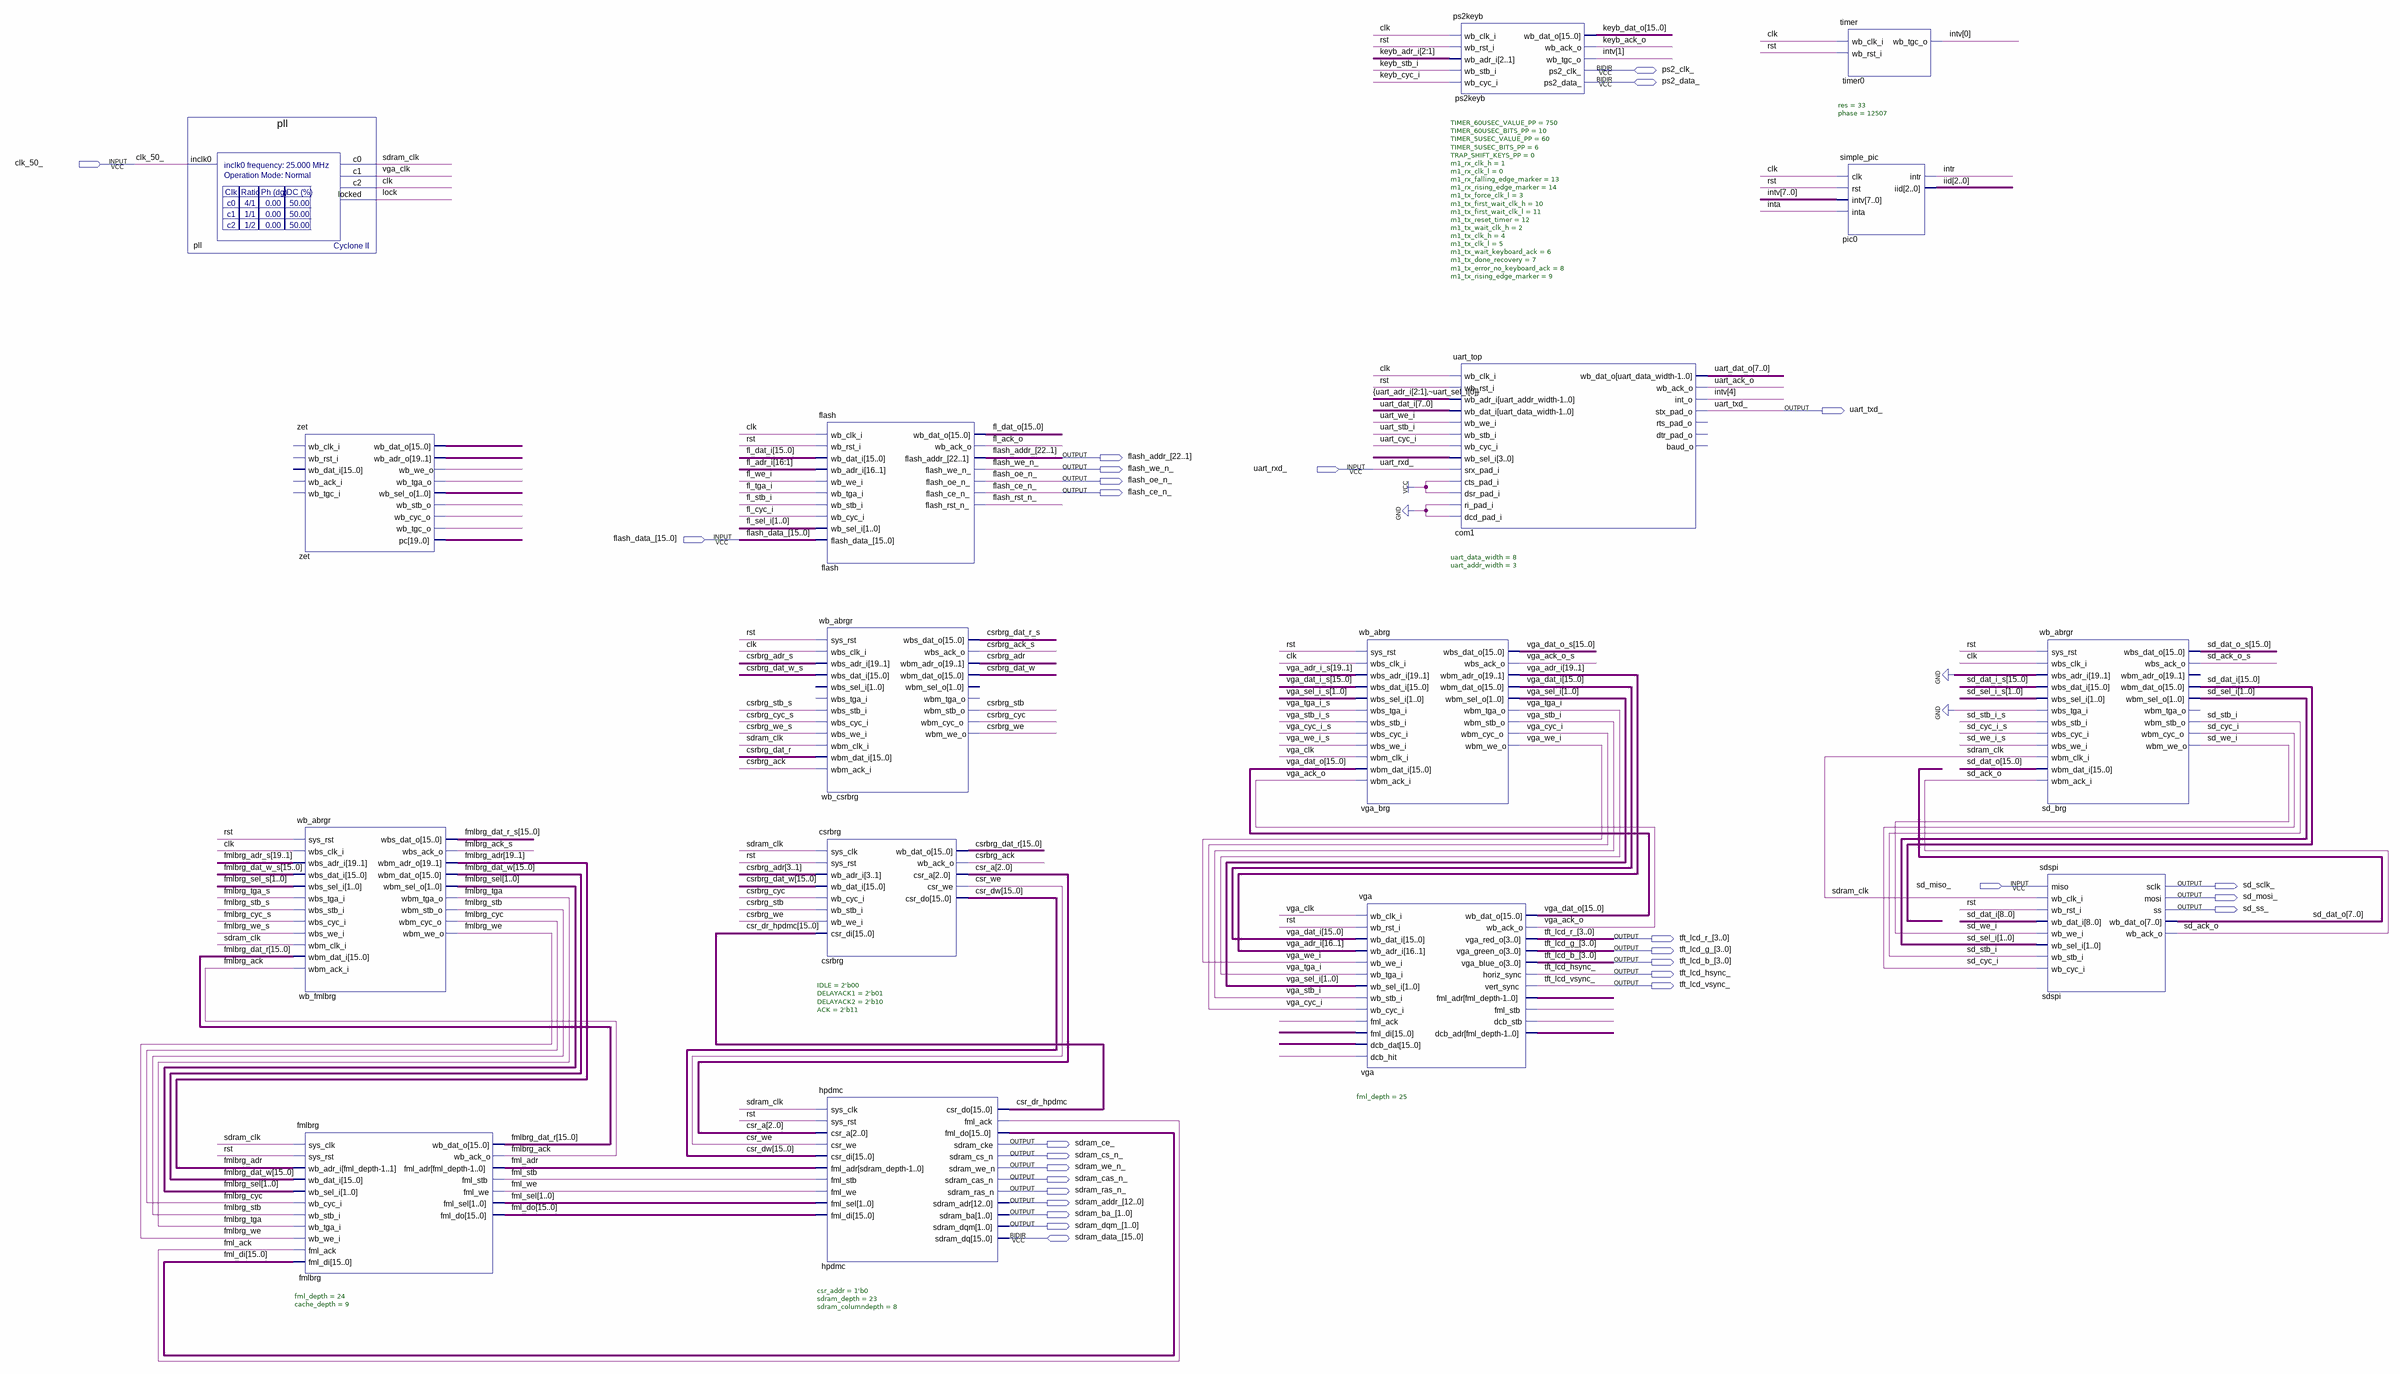
[diagram p0: schematic sheet]
// Quartus schematic Zet_Top_Level.bdf as structural Verilog: 16 symbols, 28 pins
module Zet_Top_Level (
  input  clk_50_,
  input  uart_rxd_,
  input  [15:0] flash_data_,
  input  sd_miso_,
  inout  ps2_clk_,
  inout  ps2_data_,
  inout  [15:0] sdram_data_,
  output uart_txd_,
  output [22:1] flash_addr_,
  output flash_we_n_,
  output flash_oe_n_,
  output flash_ce_n_,
  output sd_sclk_,
  output sd_mosi_,
  output sd_ss_,
  output [3:0] tft_lcd_r_,
  output [3:0] tft_lcd_g_,
  output [3:0] tft_lcd_b_,
  output tft_lcd_hsync_,
  output tft_lcd_vsync_,
  output sdram_ce_,
  output sdram_cs_n_,
  output sdram_we_n_,
  output sdram_cas_n_,
  output sdram_ras_n_,
  output [12:0] sdram_addr_,
  output [1:0] sdram_ba_,
  output [1:0] sdram_dqm_
);

  wire clk, csr_dr_hpdmc_1bit, csr_we, csrbrg_ack, csrbrg_ack_s, csrbrg_adr_1bit, csrbrg_adr_s, csrbrg_cyc,
       csrbrg_cyc_s, csrbrg_dat_r_1bit, csrbrg_dat_r_s, csrbrg_dat_w_1bit, csrbrg_dat_w_s, csrbrg_stb,
       csrbrg_stb_s, csrbrg_we, csrbrg_we_s, fl_ack_o, fl_cyc_i, fl_stb_i, fl_tga_i, fl_we_i, flash_rst_n_,
       fml_ack, fml_adr, fml_stb, fml_we, fmlbrg_ack, fmlbrg_ack_s, fmlbrg_adr_1bit, fmlbrg_cyc,
       fmlbrg_cyc_s, fmlbrg_stb, fmlbrg_stb_s, fmlbrg_tga, fmlbrg_tga_s, fmlbrg_we, fmlbrg_we_s, inta, intr,
       keyb_ack_o, keyb_cyc_i, keyb_stb_i, lock, rst, sd_ack_o, sd_ack_o_s, sd_cyc_i, sd_cyc_i_s, sd_stb_i,
       sd_stb_i_s, sd_we_i, sd_we_i_s, sdram_clk, uart_ack_o, uart_cyc_i, uart_stb_i, uart_we_i, undriven_3,
       undriven_4, vga_ack_o, vga_ack_o_s, vga_clk, vga_cyc_i, vga_cyc_i_s, vga_dcb_stb, vga_fml_stb,
       vga_stb_i, vga_stb_i_s, vga_tga_i, vga_tga_i_s, vga_we_i, vga_we_i_s, zet_wb_cyc_o, zet_wb_stb_o,
       zet_wb_tga_o, zet_wb_tgc_o, zet_wb_we_o, \~uart_sel_i[0]} ;
  wire [1:0] fl_sel_i, fml_sel, fmlbrg_sel, fmlbrg_sel_s, sd_sel_i, sd_sel_i_s, vga_sel_i, vga_sel_i_s,
       zet_wb_sel_o;
  wire [2:0] csr_a, iid;
  wire [2:1] keyb_adr_i, \{uart_adr_i ;
  wire [3:0] undriven_5;
  wire [3:1] csrbrg_adr;
  wire [7:0] intv, uart_dat_i, uart_dat_o;
  wire [15:0] csr_dr_hpdmc, csr_dw, csrbrg_dat_r, csrbrg_dat_w, fl_dat_i, fl_dat_o, fml_di, fml_do,
       fmlbrg_dat_r, fmlbrg_dat_r_s, fmlbrg_dat_w, fmlbrg_dat_w_s, keyb_dat_o, sd_dat_i, sd_dat_i_s,
       sd_dat_o, sd_dat_o_s, undriven, undriven_2, vga_dat_i, vga_dat_i_s, vga_dat_o, vga_dat_o_s,
       zet_wb_dat_o;
  wire [16:1] fl_adr_i;
  wire [18:0] zet_wb_adr_o;
  wire [19:0] zet_pc;
  wire [19:1] fmlbrg_adr, fmlbrg_adr_s, vga_adr_i, vga_adr_i_s;
  wire [24:0] vga_dcb_adr, vga_fml_adr;

  pll pll (.inclk0(clk_50_), .c0(sdram_clk), .c1(vga_clk), .c2(clk), .locked(lock));
  zet zet (
    .wb_dat_o(zet_wb_dat_o), .wb_adr_o(zet_wb_adr_o), .wb_we_o(zet_wb_we_o), .wb_tga_o(zet_wb_tga_o),
    .wb_sel_o(zet_wb_sel_o), .wb_stb_o(zet_wb_stb_o), .wb_cyc_o(zet_wb_cyc_o), .wb_tgc_o(zet_wb_tgc_o),
    .pc(zet_pc));  // open: wb_clk_i, wb_rst_i, wb_dat_i, wb_ack_i, wb_tgc_i
  wb_abrgr wb_fmlbrg (
    .sys_rst(rst), .wbs_clk_i(clk), .wbs_adr_i(fmlbrg_adr_s), .wbs_dat_i(fmlbrg_dat_w_s),
    .wbs_sel_i(fmlbrg_sel_s), .wbs_tga_i(fmlbrg_tga_s), .wbs_stb_i(fmlbrg_stb_s), .wbs_cyc_i(fmlbrg_cyc_s),
    .wbs_we_i(fmlbrg_we_s), .wbm_clk_i(sdram_clk), .wbm_dat_i(fmlbrg_dat_r), .wbm_ack_i(fmlbrg_ack),
    .wbs_dat_o(fmlbrg_dat_r_s), .wbs_ack_o(fmlbrg_ack_s), .wbm_adr_o(fmlbrg_adr), .wbm_dat_o(fmlbrg_dat_w),
    .wbm_sel_o(fmlbrg_sel), .wbm_tga_o(fmlbrg_tga), .wbm_stb_o(fmlbrg_stb), .wbm_cyc_o(fmlbrg_cyc),
    .wbm_we_o(fmlbrg_we));
  fmlbrg #(.fml_depth(24), .cache_depth(9)) fmlbrg (
    .sys_clk(sdram_clk), .sys_rst(rst), .wb_adr_i({23{fmlbrg_adr_1bit}}), .wb_dat_i(fmlbrg_dat_w),
    .wb_sel_i(fmlbrg_sel), .wb_cyc_i(fmlbrg_cyc), .wb_stb_i(fmlbrg_stb), .wb_tga_i(fmlbrg_tga),
    .wb_we_i(fmlbrg_we), .fml_ack(fml_ack), .fml_di(fml_di), .wb_dat_o(fmlbrg_dat_r), .wb_ack_o(fmlbrg_ack),
    .fml_adr(fml_adr), .fml_stb(fml_stb), .fml_we(fml_we), .fml_sel(fml_sel), .fml_do(fml_do));
  flash flash (
    .wb_clk_i(clk), .wb_rst_i(rst), .wb_dat_i(fl_dat_i), .wb_adr_i(fl_adr_i), .wb_we_i(fl_we_i),
    .wb_tga_i(fl_tga_i), .wb_stb_i(fl_stb_i), .wb_cyc_i(fl_cyc_i), .wb_sel_i(fl_sel_i),
    .flash_data_(flash_data_), .wb_dat_o(fl_dat_o), .wb_ack_o(fl_ack_o), .flash_addr_(flash_addr_),
    .flash_we_n_(flash_we_n_), .flash_oe_n_(flash_oe_n_), .flash_ce_n_(flash_ce_n_),
    .flash_rst_n_(flash_rst_n_));
  wb_abrgr wb_csrbrg (
    .sys_rst(rst), .wbs_clk_i(clk), .wbs_adr_i({19{csrbrg_adr_s}}), .wbs_dat_i({16{csrbrg_dat_w_s}}),
    .wbs_stb_i(csrbrg_stb_s), .wbs_cyc_i(csrbrg_cyc_s), .wbs_we_i(csrbrg_we_s), .wbm_clk_i(sdram_clk),
    .wbm_dat_i({16{csrbrg_dat_r_1bit}}), .wbm_ack_i(csrbrg_ack), .wbs_dat_o(csrbrg_dat_r_s),
    .wbs_ack_o(csrbrg_ack_s), .wbm_adr_o(csrbrg_adr_1bit), .wbm_dat_o(csrbrg_dat_w_1bit),
    .wbm_stb_o(csrbrg_stb), .wbm_cyc_o(csrbrg_cyc), .wbm_we_o(csrbrg_we));  // open: wbs_sel_i, wbs_tga_i, wbm_sel_o, wbm_tga_o
  csrbrg #(.IDLE(2'b00), .DELAYACK1(2'b01), .DELAYACK2(2'b10), .ACK(2'b11)) csrbrg (
    .sys_clk(sdram_clk), .sys_rst(rst), .wb_adr_i(csrbrg_adr), .wb_dat_i(csrbrg_dat_w),
    .wb_cyc_i(csrbrg_cyc), .wb_stb_i(csrbrg_stb), .wb_we_i(csrbrg_we), .csr_di(csr_dr_hpdmc),
    .wb_dat_o(csrbrg_dat_r), .wb_ack_o(csrbrg_ack), .csr_a(csr_a), .csr_we(csr_we), .csr_do(csr_dw));
  hpdmc #(.csr_addr(1'b0), .sdram_depth(23), .sdram_columndepth(8)) hpdmc (
    .sys_clk(sdram_clk), .sys_rst(rst), .csr_a(csr_a), .csr_we(csr_we), .csr_di(csr_dw),
    .fml_adr({23{fml_adr}}), .fml_stb(fml_stb), .fml_we(fml_we), .fml_sel(fml_sel), .fml_di(fml_do),
    .csr_do(csr_dr_hpdmc_1bit), .fml_ack(fml_ack), .fml_do(fml_di), .sdram_cke(sdram_ce_),
    .sdram_cs_n(sdram_cs_n_), .sdram_we_n(sdram_we_n_), .sdram_cas_n(sdram_cas_n_),
    .sdram_ras_n(sdram_ras_n_), .sdram_adr(sdram_addr_), .sdram_ba(sdram_ba_), .sdram_dqm(sdram_dqm_),
    .sdram_dq(sdram_data_));
  wb_abrg vga_brg (
    .sys_rst(rst), .wbs_clk_i(clk), .wbs_adr_i(vga_adr_i_s), .wbs_dat_i(vga_dat_i_s),
    .wbs_sel_i(vga_sel_i_s), .wbs_tga_i(vga_tga_i_s), .wbs_stb_i(vga_stb_i_s), .wbs_cyc_i(vga_cyc_i_s),
    .wbs_we_i(vga_we_i_s), .wbm_clk_i(vga_clk), .wbm_dat_i(vga_dat_o), .wbm_ack_i(vga_ack_o),
    .wbs_dat_o(vga_dat_o_s), .wbs_ack_o(vga_ack_o_s), .wbm_adr_o(vga_adr_i), .wbm_dat_o(vga_dat_i),
    .wbm_sel_o(vga_sel_i), .wbm_tga_o(vga_tga_i), .wbm_stb_o(vga_stb_i), .wbm_cyc_o(vga_cyc_i),
    .wbm_we_o(vga_we_i));
  vga #(.fml_depth(25)) vga (
    .wb_clk_i(vga_clk), .wb_rst_i(rst), .wb_dat_i(vga_dat_i), .wb_adr_i(vga_adr_i[16:1]), .wb_we_i(vga_we_i),
    .wb_tga_i(vga_tga_i), .wb_sel_i(vga_sel_i), .wb_stb_i(vga_stb_i), .wb_cyc_i(vga_cyc_i),
    .fml_ack(undriven_3), .fml_di(undriven), .dcb_dat(undriven_2), .dcb_hit(undriven_4),
    .wb_dat_o(vga_dat_o), .wb_ack_o(vga_ack_o), .vga_red_o(tft_lcd_r_), .vga_green_o(tft_lcd_g_),
    .vga_blue_o(tft_lcd_b_), .horiz_sync(tft_lcd_hsync_), .vert_sync(tft_lcd_vsync_), .fml_adr(vga_fml_adr),
    .fml_stb(vga_fml_stb), .dcb_stb(vga_dcb_stb), .dcb_adr(vga_dcb_adr));
  ps2keyb #(.TIMER_60USEC_VALUE_PP(750), .TIMER_60USEC_BITS_PP(10), .TIMER_5USEC_VALUE_PP(60), .TIMER_5USEC_BITS_PP(6), .TRAP_SHIFT_KEYS_PP(0), .m1_rx_clk_h(1), .m1_rx_clk_l(0), .m1_rx_falling_edge_marker(13), .m1_rx_rising_edge_marker(14), .m1_tx_force_clk_l(3), .m1_tx_first_wait_clk_h(10), .m1_tx_first_wait_clk_l(11), .m1_tx_reset_timer(12), .m1_tx_wait_clk_h(2), .m1_tx_clk_h(4), .m1_tx_clk_l(5), .m1_tx_wait_keyboard_ack(6), .m1_tx_done_recovery(7), .m1_tx_error_no_keyboard_ack(8), .m1_tx_rising_edge_marker(9)) ps2keyb (
    .wb_clk_i(clk), .wb_rst_i(rst), .wb_adr_i(keyb_adr_i), .wb_stb_i(keyb_stb_i), .wb_cyc_i(keyb_cyc_i),
    .wb_dat_o(keyb_dat_o), .wb_ack_o(keyb_ack_o), .wb_tgc_o(intv[1]), .ps2_clk_(ps2_clk_),
    .ps2_data_(ps2_data_));
  uart_top #(.uart_data_width(8), .uart_addr_width(3)) com1 (
    .wb_clk_i(clk), .wb_rst_i(rst), .wb_adr_i({\{uart_adr_i , \~uart_sel_i[0]} }), .wb_dat_i(uart_dat_i),
    .wb_we_i(uart_we_i), .wb_stb_i(uart_stb_i), .wb_cyc_i(uart_cyc_i), .wb_sel_i(undriven_5),
    .srx_pad_i(uart_rxd_), .cts_pad_i(1'b1), .dsr_pad_i(1'b1), .ri_pad_i(1'b0), .dcd_pad_i(1'b0),
    .wb_dat_o(uart_dat_o), .wb_ack_o(uart_ack_o), .int_o(intv[4]), .stx_pad_o(uart_txd_));  // open: rts_pad_o, dtr_pad_o, baud_o
  timer #(.res(33), .phase(12507)) timer0 (.wb_clk_i(clk), .wb_rst_i(rst), .wb_tgc_o(intv[0]));
  simple_pic pic0 (.clk(clk), .rst(rst), .intv(intv), .inta(inta), .intr(intr), .iid(iid));
  wb_abrgr sd_brg (
    .sys_rst(rst), .wbs_clk_i(clk), .wbs_adr_i({19{1'b0}}), .wbs_dat_i(sd_dat_i_s), .wbs_sel_i(sd_sel_i_s),
    .wbs_tga_i(1'b0), .wbs_stb_i(sd_stb_i_s), .wbs_cyc_i(sd_cyc_i_s), .wbs_we_i(sd_we_i_s),
    .wbm_clk_i(sdram_clk), .wbm_dat_i(sd_dat_o), .wbm_ack_i(sd_ack_o), .wbs_dat_o(sd_dat_o_s),
    .wbs_ack_o(sd_ack_o_s), .wbm_dat_o(sd_dat_i), .wbm_sel_o(sd_sel_i), .wbm_stb_o(sd_stb_i),
    .wbm_cyc_o(sd_cyc_i), .wbm_we_o(sd_we_i));  // open: wbm_adr_o, wbm_tga_o
  sdspi sdspi (
    .miso(sd_miso_), .wb_clk_i(sdram_clk), .wb_rst_i(rst), .wb_dat_i(sd_dat_i[8:0]), .wb_we_i(sd_we_i),
    .wb_sel_i(sd_sel_i), .wb_stb_i(sd_stb_i), .wb_cyc_i(sd_cyc_i), .sclk(sd_sclk_), .mosi(sd_mosi_),
    .ss(sd_ss_), .wb_dat_o(sd_dat_o[7:0]), .wb_ack_o(sd_ack_o));
endmodule
